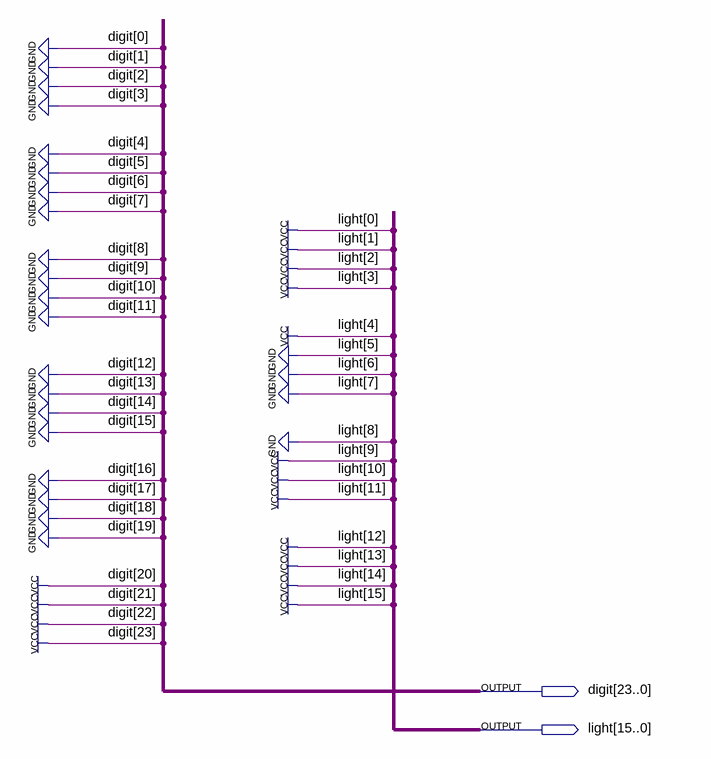
[diagram p0: schematic sheet]
// Quartus schematic Pattern_6_Frame_5.bdf as structural Verilog: 0 symbols, 2 pins
module Pattern_6_Frame_5 (
  output [23:0] digit,
  output [15:0] light
);


  assign digit = 24'b111100000000000000000000;
  assign light = 16'b1111111000011111;
endmodule
